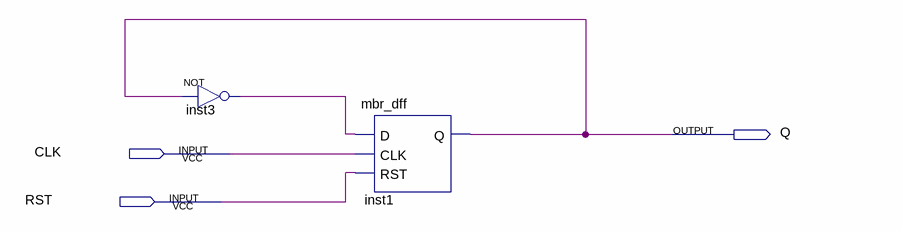
[diagram p0: schematic sheet]
// Quartus schematic mbr_div_freq_1b.bdf as structural Verilog: 2 symbols, 3 pins
module mbr_div_freq_1b (
  input  CLK,
  input  RST,
  output Q
);

  wire inst3_out;

  not inst3 (inst3_out, Q);
  mbr_dff inst1 (.D(inst3_out), .CLK(CLK), .RST(RST), .Q(Q));
endmodule
